# EAGLE schematic FTD232rl_breakout (EAGLE 7.1.0)
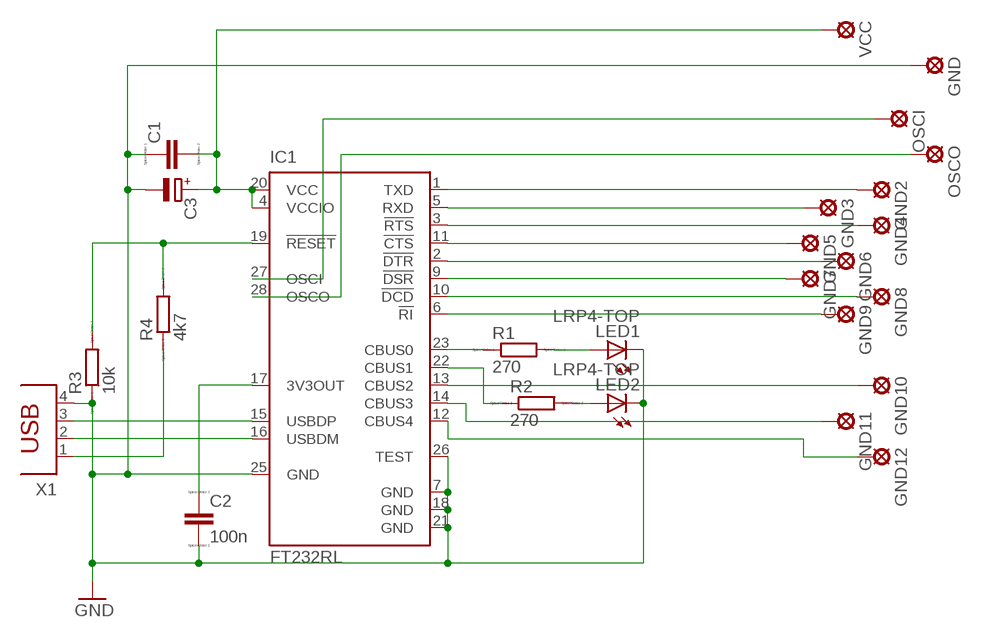
[diagram p0: schematic, sheet 1]

## Parts
C1  C-EUC0603K  [C0603K]
C2  100n  C-EUC0603K  [C0603K]
C3  CPOL-EU153CLV-0505  [153CLV-0505]
GND  LSP10  [LSP10]
GND2  LSP10  [LSP10]
GND3  LSP10  [LSP10]
GND4  LSP10  [LSP10]
GND5  LSP10  [LSP10]
GND6  LSP10  [LSP10]
GND7  LSP10  [LSP10]
GND8  LSP10  [LSP10]
GND9  LSP10  [LSP10]
GND10  LSP10  [LSP10]
GND11  LSP10  [LSP10]
GND12  LSP10  [LSP10]
IC1  FT232RL  [SSOP28]
LED1  LRP4-TOP  [P47F-TOP]
LED2  LRP4-TOP  [P47F-TOP]
OSCI  LSP10  [LSP10]
OSCO  LSP10  [LSP10]
R1  270  R-EU_0207_10  [0207/10]
R2  270  R-EU_0207_10  [0207/10]
R3  10k  R-EU_0207_10  [0207/10]
R4  4k7  R-EU_0207_10  [0207/10]
VCC  LSP10  [LSP10]
X1  PN87520  [PN87520]

## Nets
GND: C1.1 C2.2 C3.- GND.MP IC1.7(GND) IC1.18(GND) IC1.21(GND) IC1.25(GND) IC1.26(TEST) LED1.C LED2.C R3.1 X1.4
N$1: IC1.23(CBUS0) R1.1
N$2: IC1.22(CBUS1) R2.1
N$3: LED2.A R2.2
N$4: LED1.A R1.2
N$5: IC1.15(USBDP) X1.3
N$6: IC1.16(USBDM) X1.2
N$7: IC1.19(!RESET) R3.2 R4.2
N$8: R4.1 X1.1
N$9: GND3.MP IC1.5(RXD)
N$10: C1.2 C3.+ IC1.4(VCCIO) IC1.20(VCC) VCC.MP
N$11: C2.1 IC1.17(3V3OUT)
N$12: GND4.MP IC1.3(!RTS)
N$13: GND2.MP IC1.1(TXD)
N$14: GND5.MP IC1.11(!CTS)
N$15: GND6.MP IC1.2(!DTR)
N$16: GND7.MP IC1.9(!DSR)
N$17: GND8.MP IC1.10(!DCD)
N$18: GND9.MP IC1.6(!RI)
N$19: IC1.27(OSCI) OSCI.MP
N$20: GND10.MP IC1.13(CBUS2)
N$21: GND11.MP IC1.14(CBUS3)
N$22: GND12.MP IC1.12(CBUS4)
N$23: IC1.28(OSCO) OSCO.MP

## Library data of the parts
C1 C2 = resistor:C-EU: CAPACITOR, European symbol; SPICEPREFIX: C
C3 = resistor:CPOL-EU: POLARIZED CAPACITOR, European symbol
GND GND2-GND12 OSCI OSCO VCC = solpad:LSP10: SOLDER PAD drill 1.0 mm, distributor Buerklin, 12H555
IC1 = ftdichip:FT232R: Source: http://www.ftdichip.com/Documents/DataSheets/DS_FT232R_v104.pdf; MPN: FT232RL; OC_FARNELL: 1146032; OC_NEWARK: 91K9918
LED1 LED2 = led:*P4: PointLED® Enhanced Thinfilm LED TOP & BOTTOM mount LS P47F, LR P47F, LA P47F, LY P47F, LT P4SG, LB P4SG, LW P4SG Source: http://catalog.osram-os.com .. LA_LR_LS_LY_P47F_Pb_free.pdf
R1 R3 R4 = resistor:R-EU_: RESISTOR, European symbol; SPICEPREFIX: 270
R2 = resistor:R-EU_: RESISTOR, European symbol; SPICEPREFIX: R
X1 = con-berg:PN87520: BERG USB connector; OC_FARNELL: unknown; OC_NEWARK: unknown